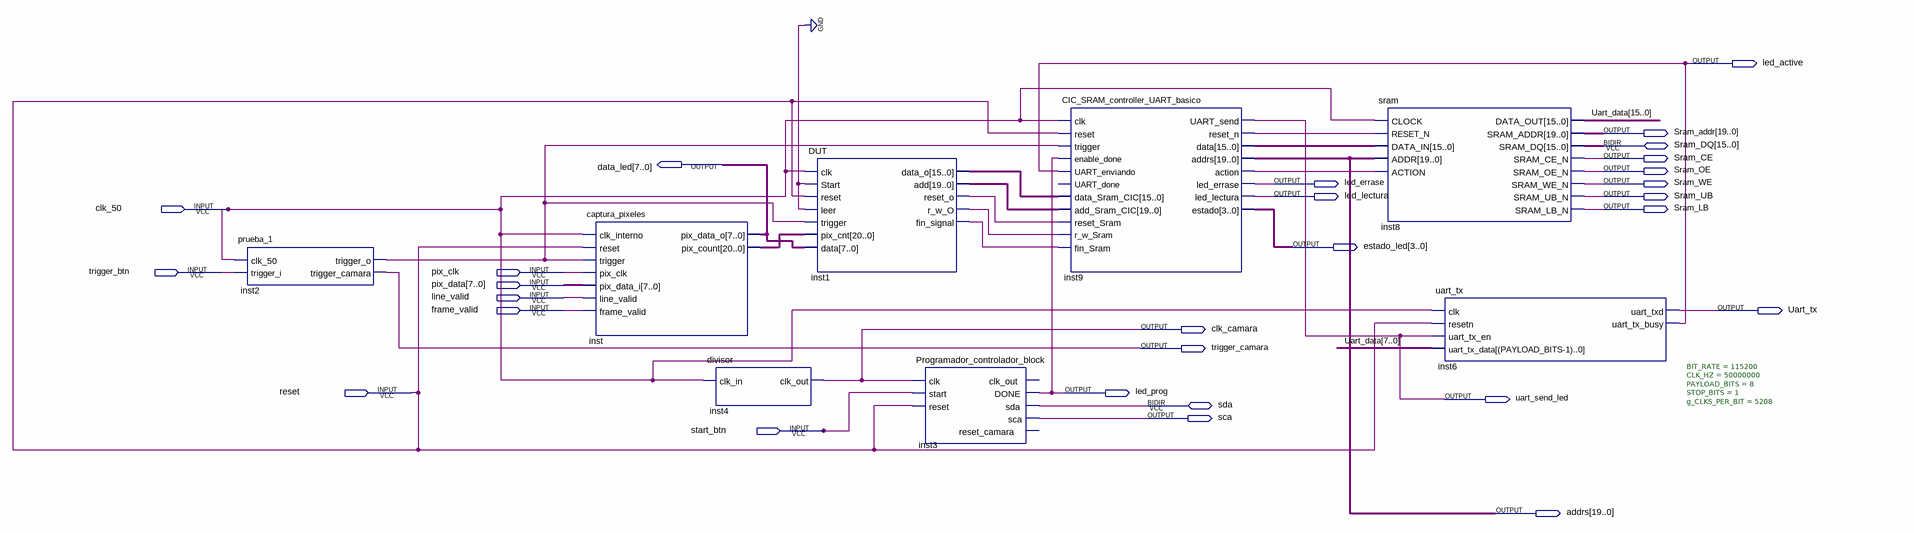
[diagram p0: schematic sheet]
// Quartus schematic sram_cic_v2.bdf as structural Verilog: 8 symbols, 28 pins
module sram_cic_v2 (
  input  clk_50,
  input  trigger_btn,
  input  pix_clk,
  input  [7:0] pix_data,
  input  line_valid,
  input  frame_valid,
  input  reset,
  input  start_btn,
  inout  [15:0] Sram_DQ,
  inout  sda,
  output led_active,
  output [19:0] Sram_addr,
  output Sram_CE,
  output [7:0] data_led,
  output Sram_OE,
  output led_errase,
  output Sram_WE,
  output led_lectura,
  output Sram_UB,
  output Sram_LB,
  output [3:0] estado_led,
  output Uart_tx,
  output clk_camara,
  output trigger_camara,
  output led_prog,
  output uart_send_led,
  output sca,
  output [19:0] addrs
);

  wire inst1_fin_signal, inst1_r_w_o, inst1_reset_o, inst2_trigger_o, inst9_action, inst9_reset_n;
  wire [15:0] inst1_data_o, inst9_data, Uart_data;
  wire [19:0] inst1_add;
  wire [20:0] inst_pix_count;

  prueba_1 inst2 (
    .clk_50(clk_50), .trigger_i(trigger_btn), .trigger_o(inst2_trigger_o), .trigger_camara(trigger_camara));
  captura_pixeles inst (
    .clk_interno(clk_50), .reset(reset), .trigger(inst2_trigger_o), .pix_clk(pix_clk), .pix_data_i(pix_data),
    .line_valid(line_valid), .frame_valid(frame_valid), .pix_data_o(data_led), .pix_count(inst_pix_count));
  divisor inst4 (.clk_in(clk_50), .clk_out(clk_camara));
  DUT inst1 (
    .clk(clk_50), .Start(1'b0), .reset(reset), .leer(1'b0), .trigger(inst2_trigger_o),
    .pix_cnt(inst_pix_count), .data(data_led), .data_o(inst1_data_o), .add(inst1_add),
    .reset_o(inst1_reset_o), .r_w_O(inst1_r_w_o), .fin_signal(inst1_fin_signal));
  Programador_controlador_block inst3 (
    .clk(clk_camara), .start(start_btn), .reset(reset), .DONE(led_prog), .sca(sca), .sda(sda));  // open: clk_out, reset_camara
  CIC_SRAM_controller_UART_basico inst9 (
    .clk(clk_50), .reset(reset), .trigger(inst2_trigger_o), .enable_done(led_prog),
    .UART_enviando(led_active), .data_Sram_CIC(inst1_data_o), .add_Sram_CIC(inst1_add),
    .reset_Sram(inst1_reset_o), .r_w_Sram(inst1_r_w_o), .fin_Sram(inst1_fin_signal),
    .UART_send(uart_send_led), .reset_n(inst9_reset_n), .data(inst9_data), .addrs(addrs),
    .action(inst9_action), .led_errase(led_errase), .led_lectura(led_lectura), .estado(estado_led));  // open: UART_done
  sram inst8 (
    .CLOCK(clk_50), .RESET_N(inst9_reset_n), .DATA_IN(inst9_data), .ADDR(addrs), .ACTION(inst9_action),
    .DATA_OUT(Uart_data), .SRAM_ADDR(Sram_addr), .SRAM_CE_N(Sram_CE), .SRAM_OE_N(Sram_OE),
    .SRAM_WE_N(Sram_WE), .SRAM_UB_N(Sram_UB), .SRAM_LB_N(Sram_LB), .SRAM_DQ(Sram_DQ));
  uart_tx #(.BIT_RATE(115200), .CLK_HZ(50000000), .PAYLOAD_BITS(8), .STOP_BITS(1), .g_CLKS_PER_BIT(5208)) inst6 (
    .clk(clk_50), .resetn(reset), .uart_tx_en(uart_send_led), .uart_tx_data(Uart_data[7:0]),
    .uart_txd(Uart_tx), .uart_tx_busy(led_active));
endmodule
